# Altium schematic sheet ETH PHY.SchDoc
size A4; SheetNumber: 13; SheetTotal: 13
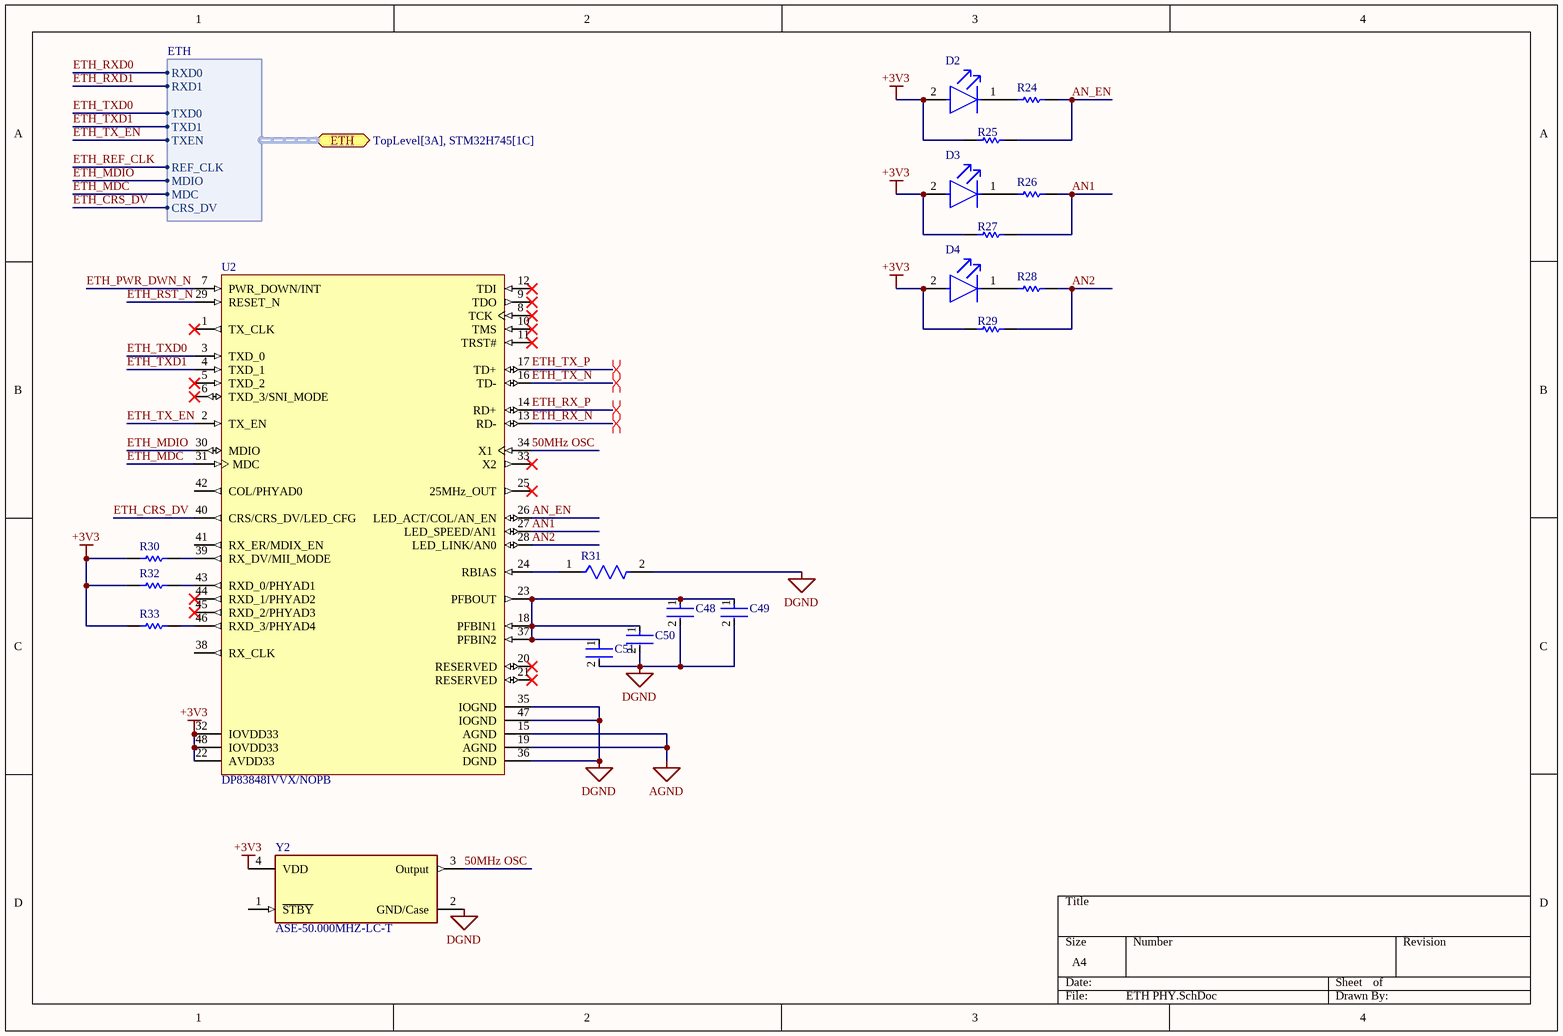
[diagram p0: ETH PHY.SchDoc]

## Parts
C48  GRM188R61A106KE69J  [FP-GRM188-0_15-MFG]  (value not drawn)
C49  CL05A104JO5NNNC  [FP-CL45-IPC_C]  (value not drawn)
C50  CL05A104JO5NNNC  [FP-CL45-IPC_C]  (value not drawn)
C51  CL05A104JO5NNNC  [FP-CL45-IPC_C]  (value not drawn)
D2  APHD1608LZGCK  [FP-APHD1608LZGCK-MFG]  (value not drawn)
D3  APHD1608LZGCK  [FP-APHD1608LZGCK-MFG]  (value not drawn)
D4  APHD1608LZGCK  [FP-APHD1608LZGCK-MFG]  (value not drawn)
R24  CRCW0603110RFKEA  [RESC1609X50X30NL10T20]  (value not drawn)
R25  RC0402JR-072K2L  [RESC1005X40X25NL5T10]  (value not drawn)
R26  CRCW0603110RFKEA  [RESC1609X50X30NL10T20]  (value not drawn)
R27  RC0402JR-072K2L  [RESC1005X40X25NL5T10]  (value not drawn)
R28  CRCW0603110RFKEA  [RESC1609X50X30NL10T20]  (value not drawn)
R29  RC0402JR-072K2L  [RESC1005X40X25NL5T10]  (value not drawn)
R30  RC0402JR-072K2L  [RESC1005X40X25NL5T10]  (value not drawn)
R31  RK73H1JTTD4871D  [FP-RK73H1J-IPC_C]  (value not drawn)
R32  RC0402JR-072K2L  [RESC1005X40X25NL5T10]  (value not drawn)
R33  RC0402JR-072K2L  [RESC1005X40X25NL5T10]  (value not drawn)
U2  DP83848IVVX/NOPB  [PT0048A_L]
Y2  ASE-50.000MHZ-LC-T  [FP-ASE-MFG]

## Ports
ETH (bidir, harness ETH, see TopLevel[3A], STM32H745[1C])

## Harnesses
ETH: RXD0, RXD1, TXD0, TXD1, REF_CLK, MDIO, MDC, CRS_DV, TXEN

## Nets
+3V3: D2.2(A) D3.2(A) D4.2(A) R25.2 R27.2 R29.2 R30.2 R32.2 R33.2 U2.22(AVDD33) U2.32(IOVDD33) U2.48(IOVDD33) Y2.4(VDD)
AGND: U2.15(AGND) U2.19(AGND)
DGND: C48.2 C49.2 C50.2 C51.2 R31.2 U2.35(IOGND) U2.36(DGND) U2.47(IOGND) Y2.2(GND/Case)
50MHz OSC: U2.34(X1) Y2.3(Output)
AN1: R26.2 R27.1 U2.27(LED_SPEED/AN1)
AN2: R28.2 R29.1 U2.28(LED_LINK/AN0)
AN_EN: R24.2 R25.1 U2.26(LED_ACT/COL/AN_EN)
ETH_CRS_DV: U2.40(CRS/CRS_DV/LED_CFG) ; port ETH.CRS_DV
ETH_MDC: U2.31(MDC) ; port ETH.MDC
ETH_MDIO: U2.30(MDIO) ; port ETH.MDIO
ETH_PWR_DWN_N: U2.7(PWR_DOWN/INT)
ETH_REF_CLK: port ETH.REF_CLK
ETH_RST_N: U2.29(RESET_N)
ETH_RX_N: U2.13(RD-)
ETH_RX_P: U2.14(RD+)
ETH_RXD0: port ETH.RXD0
ETH_RXD1: port ETH.RXD1
ETH_TX_EN: U2.2(TX_EN) ; port ETH.TXEN
ETH_TX_N: U2.16(TD-)
ETH_TX_P: U2.17(TD+)
ETH_TXD0: U2.3(TXD_0) ; port ETH.TXD0
ETH_TXD1: U2.4(TXD_1) ; port ETH.TXD1
NetC48_1: C48.1 C49.1 C50.1 C51.1 U2.18(PFBIN1) U2.23(PFBOUT) U2.37(PFBIN2)
NetD2_1: D2.1(C) R24.1
NetD3_1: D3.1(C) R26.1
NetD4_1: D4.1(C) R28.1
NetR30_1: R30.1 U2.39(RX_DV/MII_MODE)
NetR31_1: R31.1 U2.24(RBIAS)
NetR32_1: R32.1 U2.43(RXD_0/PHYAD1)
NetR33_1: R33.1 U2.46(RXD_3/PHYAD4)

Not connected (* = marked no-connect by the designer): U2 1(TX_CLK)* 5(TXD_2)* 6(TXD_3/SNI_MODE)* 8(TCK)* 9(TDO)* 10(TMS)* 11(TRST#)* 12(TDI)* 20(RESERVED)* 21(RESERVED)* 25(25MHz_OUT)* 33(X2)* 38(RX_CLK) 41(RX_ER/MDIX_EN) 42(COL/PHYAD0) 44(RXD_1/PHYAD2)* 45(RXD_2/PHYAD3)*; Y2 1(~{STBY})

## Layout directives
differential pair: ETH_RX_N, ETH_RX_P, ETH_TX_N, ETH_TX_P

## Library data of the parts
C48 = CMP-06035-062693-1: CAP CER 10UF 10V X5R 0603; Tolerance: 10%; Capacitance: 10uF; Width: 800um; Length: 1.6mm; Voltage Rating (DC): 10V; RoHS Compliant: Yes; Thickness: 800um; Dielectric: X5R
C49-C51 = CMP-13271-002775-1: Cap Ceramic 100nF 16V X5R ±5% SMD 0402 +85°C Paper T/R; Width: 0.02inch; Mount: Surface Mount; Length: 0.039inch; Case Code (Metric): 1005; Packaging: Tape and Reel; Package Quantity: 1; Case/Package: 0402; Capacitance: 100nF; Thickness: 0.022inch; Voltage Rating (DC): 16V; Tolerance: 5%; Max Operating Temperature: 85°C; Case Code (Imperial): 0402; Voltage Rating: 16V; Min Operating Temperature: -55°C
D2-D4 = CMP-44529-000045-1: LED GREEN CLEAR 1608 SMD; Test Current: 2mA; Dominant Wavelength: 525nm; Lens Color: Colorless; Luminous Intensity: 180mcd; Viewing Angle: 100°; Forward Voltage: 2.65V; Lens Size: 0.7mm; Lens Style: Round; Mount: Surface Mount; Packaging: Tape and Reel; Lens Transparency: Clear; Height: 0.75mm; Case/Package: 0603; Length: 1.6mm; Case Code (Metric): 1608; Width: 0.8mm; Color: Green; Case Code (Imperial): 0603
R24 R26 R28 = CMP-2000-03854-1: Manufacturer: Vishay Dale; Part Number: CRCW0603110RFKEA
R25 R27 R29 R30 R32 R33 = CMP-2002-07969-2: Chip Resistor, 2.2 KOhm, +/- 5%, 0.063 W, -55 to 155 degC, 0402 (1005 Metric), RoHS, Tape and Reel; Voltage Rating (DC): 50 V; Case\Package: 0402; Power Rating: 63 mW; Case Code (Metric): 1005; PackageDescription: 2-Pin Surface Mount Device, Body 1 x 0.5 mm; ComponentLink2URL: http://www.yageo.com/documents/recent/PYu-RC_Group_51_RoHS_L_04.pdf; PackageReference: 0402; Packaging: Tape and Reel; Width: 0.5 mm; REACH SVHC: No SVHC; Tolerance: 5%; Mount: Surface Mount; Mounting Technology: Surface Mount; RoHSCompliant: true; ComponentLink1Description: Manufacturer URL; ComponentLink2Description: Datasheet; Voltage Rating: 50 V; Min Operating Temperature: -55 degC; ComponentLink1URL: http://www.yageo.com/; Resistance: 2.2 kohm; Max Operating Temperature: 155 degC; Height: 0.35 mm; Package Quantity: 10000; Pins: 2; Length: 1 mm; Case Code (Imperial): 0402; DatasheetVersion: Rev. 4, 02/2016
R31 = CMP-04015-076806-1: 4.87kΩ ±0.5% 0.1W Chip Resistor 0603 Thick Film AEC-Q200 Qualified
U2 = CMP-0058-01357-3: PHYTER® Industrial Temperature Single Port 10/100 Mb/s Ethernet Physical Layer Transceiver, 48-pin LQFP, Pb-Free, 1000 Reel; Manufacturer: Texas Instruments; CompType: Interface IC; PackageTopMarking: NSUZXYTT*DP83848VV*VBI; PowerWise: N; High-Reliability: Y; PackageDescription: LQFP, 7 x 7 x 1.4mm, 48 Lead, 0.5mm Pitch; ComponentLink1Description: Datasheet URL; PackageReference: PT0048A; PartNumber: DP83848IVVX/NOPB; ComponentLink1URL: http://www.ti.com/general/docs/lit/getliterature.tsp?genericPartNumber=DP83848I&fileType=pdf; PinCount: 48; RoHS: Y
Y2 = CMP-27762-009764-1: XTAL Oscillator 50MHz ±50ppm CMOS 3.3V 4-SMD 3.2mm x 2.5mm; Load Capacitance: 15pF; Max Supply Current: 19mA; Min Supply Voltage: 3.135V; Max Supply Voltage: 3.465V; Packaging: Tape and Reel; Height: 0.047inch; Mount: Surface Mount; Frequency Stability: 50ppm; Lead Free: Lead Free; Number of Pins: 4; Width: 0.098inch; Radiation Hardening: No; Max Operating Temperature: 85°C; Length: 3.2mm; REACH SVHC: No SVHC; Series: ASE; Depth: 2.5mm; Operating Supply Voltage: 3.3V; Min Operating Temperature: -40°C; Package Quantity: 1000; Operating Frequency: 50 MHz; Case/Package: SMD/SMT; Termination: SMD/SMT; Frequency: 50MHz